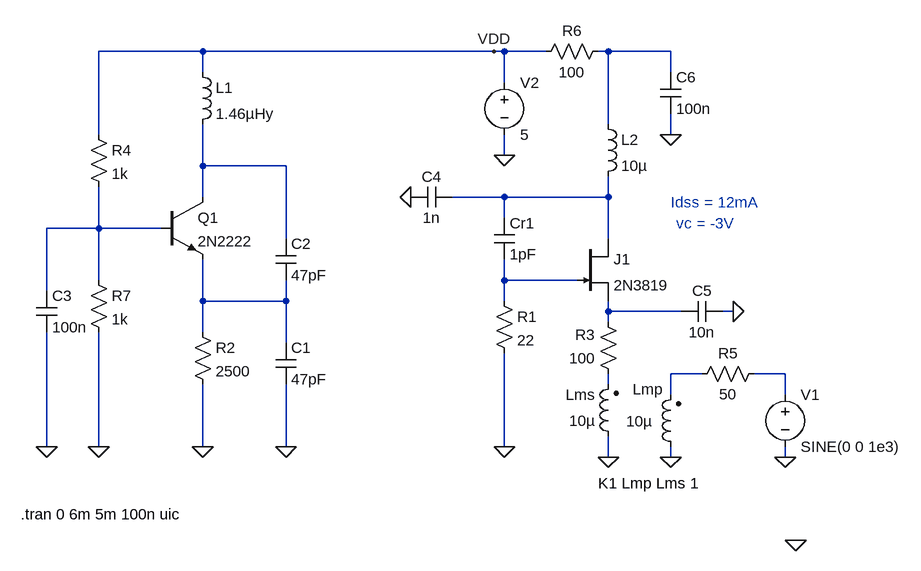
[diagram p0: schematic fet_reactancia.asc]
fet_reactancia.asc, the LTspice schematic file:
Version 4
SHEET 1 880 680
WIRE -272 -256 -432 -256
WIRE 176 -256 -272 -256
WIRE 192 -256 176 -256
WIRE 256 -256 192 -256
WIRE 352 -256 336 -256
WIRE 448 -256 352 -256
WIRE -272 -224 -272 -256
WIRE 448 -224 448 -256
WIRE 192 -208 192 -256
WIRE 352 -144 352 -256
WIRE -432 -128 -432 -256
WIRE 448 -128 448 -160
WIRE 192 -96 192 -128
WIRE -272 -80 -272 -144
WIRE -144 -80 -272 -80
WIRE -272 -32 -272 -80
WIRE 192 -32 112 -32
WIRE 352 -32 352 -64
WIRE 352 -32 192 -32
WIRE 192 0 192 -32
WIRE -432 16 -432 -48
WIRE -432 16 -512 16
WIRE -336 16 -432 16
WIRE -144 32 -144 -80
WIRE 352 32 352 -32
WIRE -432 96 -432 16
WIRE 192 96 192 64
WIRE 304 96 192 96
WIRE -512 112 -512 16
WIRE -272 128 -272 64
WIRE -144 128 -144 96
WIRE -144 128 -272 128
WIRE 192 128 192 96
WIRE 352 144 352 128
WIRE 464 144 352 144
WIRE 544 144 528 144
WIRE 352 160 352 144
WIRE -272 176 -272 128
WIRE -144 192 -144 128
WIRE 496 240 448 240
WIRE 624 240 576 240
WIRE 352 256 352 240
WIRE 448 272 448 240
WIRE 624 272 624 240
WIRE -512 352 -512 176
WIRE -432 352 -432 176
WIRE -272 352 -272 256
WIRE -144 352 -144 256
WIRE 192 352 192 208
WIRE 352 368 352 336
WIRE 448 368 448 352
WIRE 624 368 624 352
FLAG 192 352 0
FLAG 352 368 0
FLAG -272 352 0
FLAG -144 352 0
FLAG 176 -256 VDD
FLAG 624 368 0
FLAG 192 -96 0
FLAG 544 144 0
FLAG 448 368 0
FLAG 448 -128 0
FLAG 640 496 0
FLAG 48 -32 0
FLAG -432 352 0
FLAG -512 352 0
SYMBOL ind -288 -240 R0
SYMATTR InstName L1
SYMATTR Value 1.46µHy
SYMBOL cap 176 0 R0
SYMATTR InstName Cr1
SYMATTR Value 1pF
SYMBOL res 176 112 R0
SYMATTR InstName R1
SYMATTR Value 22
SYMBOL res -288 160 R0
SYMATTR InstName R2
SYMATTR Value 2500
SYMBOL cap -160 192 R0
SYMATTR InstName C1
SYMATTR Value 47pF
SYMBOL cap -160 32 R0
SYMATTR InstName C2
SYMATTR Value 47pF
SYMBOL njf 304 32 R0
SYMATTR InstName J1
SYMATTR Value 2N3819
SYMBOL voltage 624 256 R0
WINDOW 123 0 0 Left 0
WINDOW 39 24 124 Left 2
SYMATTR InstName V1
SYMATTR Value SINE(0 0 1e3)
SYMBOL voltage 192 -224 R0
WINDOW 123 0 0 Left 0
WINDOW 39 0 0 Left 0
SYMATTR InstName V2
SYMATTR Value 5
SYMBOL res 368 256 R180
WINDOW 0 36 76 Left 2
WINDOW 3 36 40 Left 2
SYMATTR InstName R3
SYMATTR Value 100
SYMBOL cap 464 160 R270
WINDOW 0 32 32 VTop 2
WINDOW 3 0 32 VBottom 2
SYMATTR InstName C5
SYMATTR Value 10n
SYMBOL ind 336 -160 R0
SYMATTR InstName L2
SYMATTR Value 10µ
SYMBOL npn -336 -32 R0
SYMATTR InstName Q1
SYMATTR Value 2N2222
SYMBOL res 592 224 R90
WINDOW 0 0 56 VBottom 2
WINDOW 3 32 56 VTop 2
SYMATTR InstName R5
SYMATTR Value 50
SYMBOL res 240 -240 R270
WINDOW 0 32 56 VTop 2
WINDOW 3 0 56 VBottom 2
SYMATTR InstName R6
SYMATTR Value 100
SYMBOL ind2 368 352 R180
WINDOW 0 36 80 Left 2
WINDOW 3 36 40 Left 2
SYMATTR InstName Lms
SYMATTR Value 10µ
SYMATTR Type ind
SYMBOL ind2 464 368 R180
WINDOW 0 27 104 Left 2
WINDOW 3 44 55 Left 2
SYMATTR InstName Lmp
SYMATTR Value 10µ
SYMATTR Type ind
SYMBOL cap 432 -224 R0
SYMATTR InstName C6
SYMATTR Value 100n
SYMBOL cap 112 -48 R90
WINDOW 0 0 32 VBottom 2
WINDOW 3 32 32 VTop 2
SYMATTR InstName C4
SYMATTR Value 1n
SYMBOL res -448 -144 R0
SYMATTR InstName R4
SYMATTR Value 1k
SYMBOL res -448 80 R0
SYMATTR InstName R7
SYMATTR Value 1k
SYMBOL cap -528 112 R0
SYMATTR InstName C3
SYMATTR Value 100n
TEXT -552 456 Left 2 !.tran 0 6m 5m 100n uic
TEXT 448 -24 Left 2 ;Idss = 12mA
TEXT 456 8 Left 2 ;vc = -3V
TEXT 336 408 Left 2 !K1 Lmp Lms 1

The netlist it stands for:
* fet_reactancia.asc
L1 VDD N002 1.46µHy
Cr1 N003 N005 1pF
R1 N005 0 22
R2 N006 0 2500
C1 N006 0 47pF
C2 N002 N006 47pF
J1 N003 N005 N007 2N3819
V1 N009 0 SINE(0 0 1e3)
V2 VDD 0 5
R3 N010 N007 100
C5 N007 0 10n
L2 N001 N003 10µ
Q1 N002 N004 N006 0 2N2222
R5 N009 N008 50
R6 VDD N001 100
Lms 0 N010 10µ
Lmp 0 N008 10µ
C6 N001 0 100n
C4 N003 0 1n
R4 VDD N004 1k
R7 N004 0 1k
C3 N004 0 100n
.model NPN NPN
.model PNP PNP
.lib standard.bjt
.model NJF NJF
.model PJF PJF
.lib standard.jft
.tran 0 6m 5m 100n uic
* Idss = 12mA
* vc = -3V
K1 Lmp Lms 1
.backanno
.end